# Altium project ConvertionBoard.PrjPcb
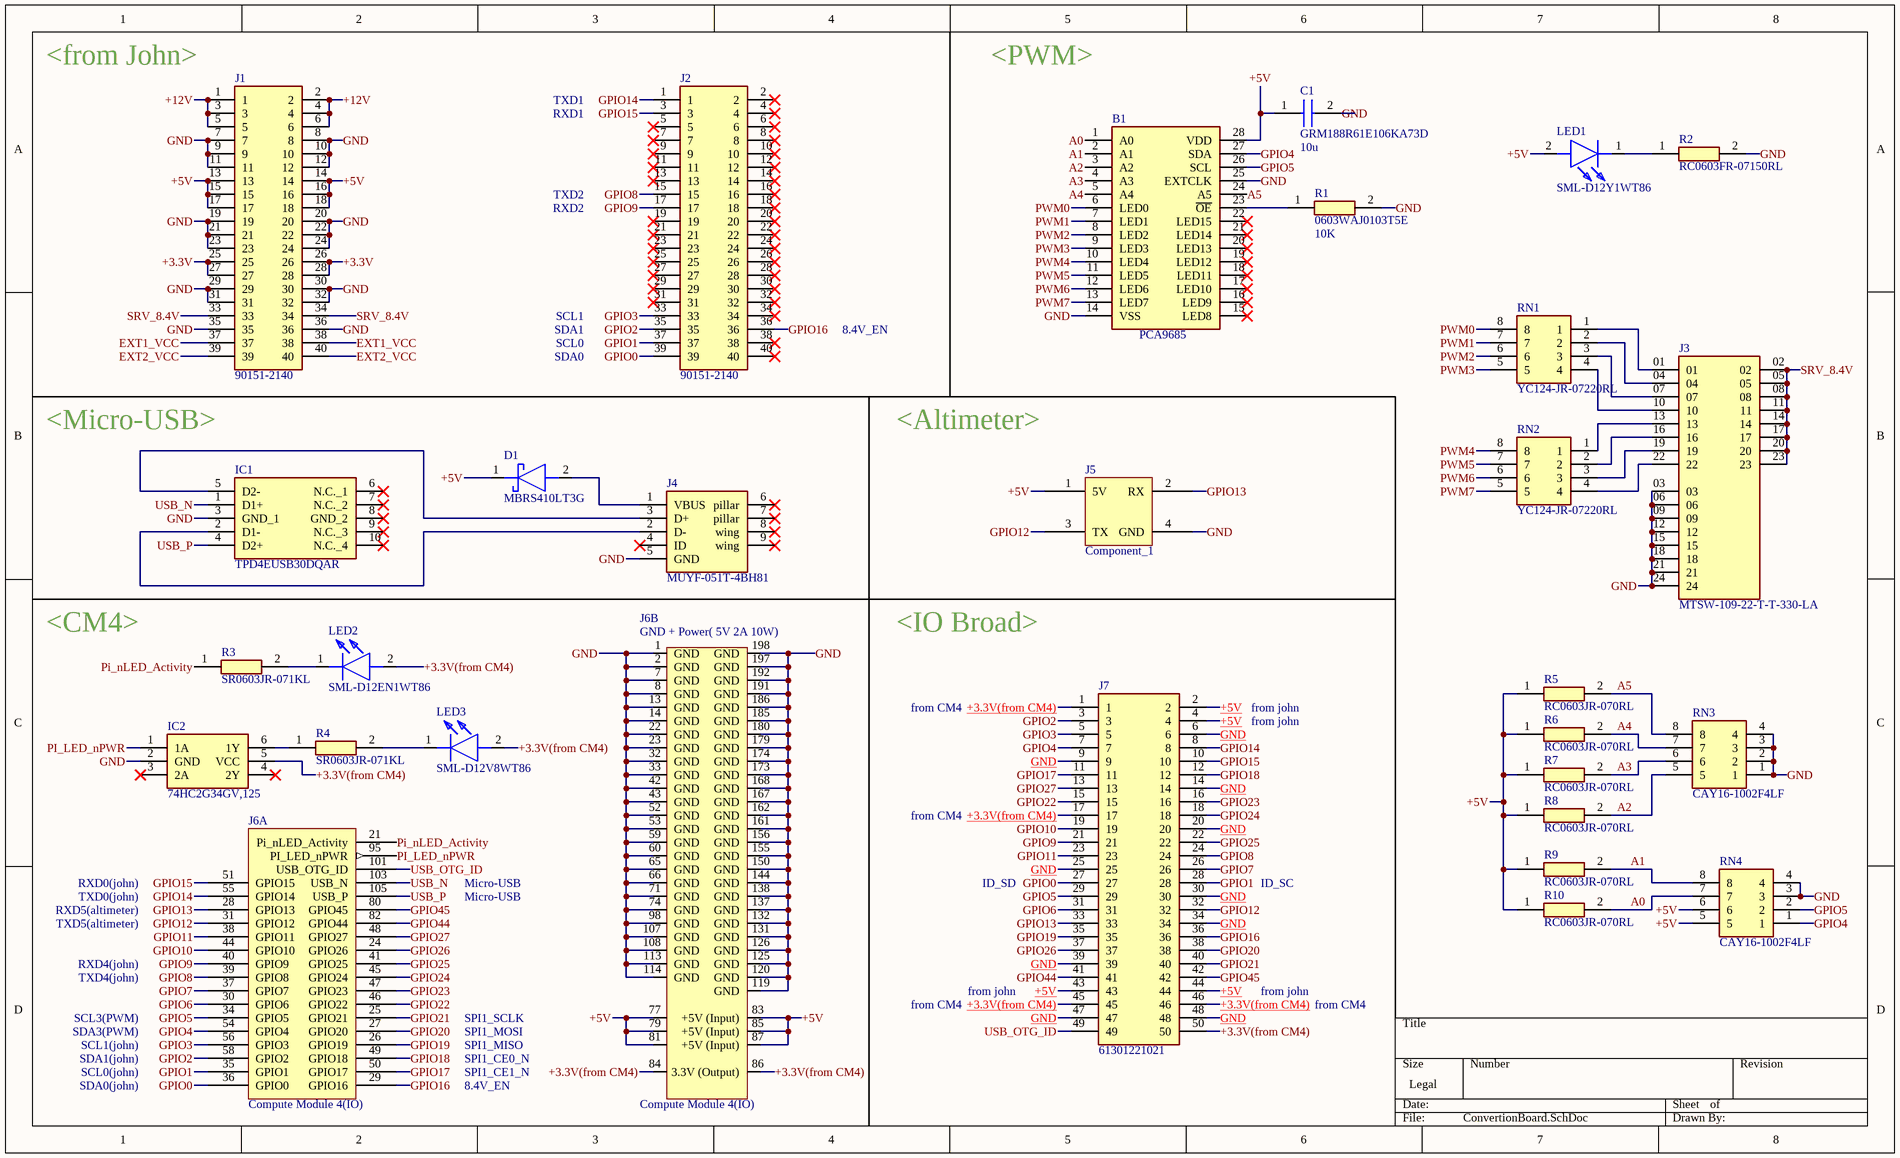
[diagram p0: ConvertionBoard.SchDoc]
1 sheet, 29 parts. Net scope: global (net labels, ports and power ports of the same name join across sheets).
Board file: ConvertionBoard.PcbDoc

## Sheet ConvertionBoard.SchDoc
size Legal

### Parts
B1  PCA9685  [PCA9685]
C1  GRM188R61E106KA73D  value 10u  [GRM18x]
D1  MBRS410LT3G  [DIOM8059X261N]
IC1  TPD4EUSB30DQAR  [DQA(R-PUSON-N10)]
IC2  74HC2G34GV,125  [SOT95P275X110-6N]
J1  90151-2140  [RHDR40W70P254_2X20_5065X498X870P]
J2  90151-2140  [RHDR40W70P254_2X20_5065X498X870P]
J3  MTSW-109-22-T-T-330-LA  [SAMTEC_MTSW-109-22-T-T-330-LA]
J4  MUYF-051T-4BH81  [473460001]
J5  Component_1  [Component_1]
J6  Compute Module 4(IO)  [CM4-F40C-100DS-0.4v_1.5mm_0mm]  (parts A,B of 2)
J7  61301221021  [61301221021 - output]
LED1  SML-D12Y1WT86  [LEDC1608X55N]
LED2  SML-D12EN1WT86  [LEDC1608X55N]
LED3  SML-D12V8WT86  [LEDC1608X55N]
R1  0603WAJ0103T5E  value 10K  [RESC1608X55N_10K]
R2  RC0603FR-07150RL  [RESC1608X55N_150]
R3  SR0603JR-071KL  [RESC1608X55N_0]
R4  SR0603JR-071KL  [RESC1608X55N_0]
R5  RC0603JR-070RL  [RESC1608X55N_0]
R6  RC0603JR-070RL  [RESC1608X55N_0]
R7  RC0603JR-070RL  [RESC1608X55N_0]
R8  RC0603JR-070RL  [RESC1608X55N_0]
R9  RC0603JR-070RL  [RESC1608X55N_0]
R10  RC0603JR-070RL  [RESC1608X55N_0]
RN1  YC124-JR-07220RL  [YC124JR07220RL]
RN2  YC124-JR-07220RL  [YC124JR07220RL]
RN3  CAY16-1002F4LF  [CAY-16-F4]
RN4  CAY16-1002F4LF  [CAY-16-F4]

### Nets
+3.3V: J1.25 J1.26 J1.27 J1.28
+3.3V(from CM4): IC2.5(VCC) J6.84(3.3V_(Output)) J6.86(3.3V_(Output)) J7.1 J7.17 J7.45 J7.46 J7.50 LED2.2(A) LED3.2(A)
+5V: B1.28(VDD) C1.1 D1.1(K) J1.13 J1.14 J1.15 J1.16 J1.17 J1.18 J5.1(5V) J6.77(+5V_(Input)) J6.79(+5V_(Input)) J6.81(+5V_(Input)) J6.83(+5V_(Input)) J6.85(+5V_(Input)) J6.87(+5V_(Input)) J7.2 J7.4 J7.43 J7.44 LED1.2(A) R5.1 R6.1 R7.1 R8.1 R9.1 R10.1 RN4.5 RN4.6
+12V: J1.1 J1.2 J1.3 J1.4 J1.5 J1.6
A0: B1.1(A0) R10.2 RN4.7
A1: B1.2(A1) R9.2 RN4.8
A2: B1.3(A2) R8.2 RN3.5
A3: B1.4(A3) R7.2 RN3.6
A4: B1.5(A4) R6.2 RN3.7
A5: B1.24(A5) R5.2 RN3.8
EXT1_VCC: J1.37 J1.38
EXT2_VCC: J1.39 J1.40
GND: B1.14(VSS) B1.25(EXTCLK) C1.2 IC1.3(GND_1) IC2.2(GND) J1.7 J1.8 J1.9 J1.10 J1.11 J1.12 J1.19 J1.20 J1.21 J1.22 J1.23 J1.24 J1.29 J1.30 J1.31 J1.32 J1.35 J1.36 J3.03 J3.06 J3.09 J3.12 J3.15 J3.18 J3.21 J3.24 J4.5(GND) J5.4(GND) J6.1(GND) J6.2(GND) J6.7(GND) J6.8(GND) J6.13(GND) J6.14(GND) J6.22(GND) J6.23(GND) J6.32(GND) J6.33(GND) J6.42(GND) J6.43(GND) J6.52(GND) J6.53(GND) J6.59(GND) J6.60(GND) J6.65(GND) J6.66(GND) J6.71(GND) J6.74(GND) J6.98(GND) J6.107(GND) J6.108(GND) J6.113(GND) J6.114(GND) J6.119(GND) J6.120(GND) J6.125(GND) J6.126(GND) J6.131(GND) J6.132(GND) J6.137(GND) J6.138(GND) J6.144(GND) J6.150(GND) J6.155(GND) J6.156(GND) J6.161(GND) J6.162(GND) J6.167(GND) J6.168(GND) J6.173(GND) J6.174(GND) J6.179(GND) J6.180(GND) J6.185(GND) J6.186(GND) J6.191(GND) J6.192(GND) J6.197(GND) J6.198(GND) J7.6 J7.9 J7.14 J7.20 J7.25 J7.30 J7.34 J7.39 J7.47 J7.48 R1.2 R2.2 RN3.1 RN3.2 RN3.3 RN3.4 RN4.3 RN4.4
GPIO0: J2.39 J6.36(GPIO0) J7.27
GPIO1: J2.37 J6.35(GPIO1) J7.28
GPIO2: J2.35 J6.58(GPIO2) J7.3
GPIO3: J2.33 J6.56(GPIO3) J7.5
GPIO4: B1.27(SDA) J6.54(GPIO4) J7.7 RN4.1
GPIO5: B1.26(SCL) J6.34(GPIO5) J7.29 RN4.2
GPIO6: J6.30(GPIO6) J7.31
GPIO7: J6.37(GPIO7) J7.26
GPIO8: J2.15 J6.39(GPIO8) J7.24
GPIO9: J2.17 J6.40(GPIO9) J7.21
GPIO10: J6.44(GPIO10) J7.19
GPIO11: J6.38(GPIO11) J7.23
GPIO12: J5.3(TX) J6.31(GPIO12) J7.32
GPIO13: J5.2(RX) J6.28(GPIO13) J7.33
GPIO14: J2.1 J6.55(GPIO14) J7.8
GPIO15: J2.3 J6.51(GPIO15) J7.10
GPIO16: J2.36 J6.29(GPIO16) J7.36
GPIO17: J6.50(GPIO17) J7.11
GPIO18: J6.49(GPIO18) J7.12
GPIO19: J6.26(GPIO19) J7.35
GPIO20: J6.27(GPIO20) J7.38
GPIO21: J6.25(GPIO21) J7.40
GPIO22: J6.46(GPIO22) J7.15
GPIO23: J6.47(GPIO23) J7.16
GPIO24: J6.45(GPIO24) J7.18
GPIO25: J6.41(GPIO25) J7.22
GPIO26: J6.24(GPIO26) J7.37
GPIO27: J6.48(GPIO27) J7.13
GPIO44: J6.82(GPIO44) J7.41
GPIO45: J6.80(GPIO45) J7.42
PI_LED_nPWR: IC2.1(1A) J6.95(PI_LED_nPWR)
Pi_nLED_Activity: J6.21(Pi_nLED_Activity) R3.1
PWM0: B1.6(LED0) RN1.8
PWM1: B1.7(LED1) RN1.7
PWM2: B1.8(LED2) RN1.6
PWM3: B1.9(LED3) RN1.5
PWM4: B1.10(LED4) RN2.8
PWM5: B1.11(LED5) RN2.7
PWM6: B1.12(LED6) RN2.6
PWM7: B1.13(LED7) RN2.5
SRV_8.4V: J1.33 J1.34 J3.02 J3.05 J3.08 J3.11 J3.14 J3.17 J3.20 J3.23
USB_N: IC1.1(D1+) J6.103(USB_N)
USB_OTG_ID: J6.101(USB_OTG_ID) J7.49
USB_P: IC1.4(D2+) J6.105(USB_P)
NetB1_23: B1.23(~{OE}) R1.1
NetD1_2: D1.2(A) J4.1(VBUS)
NetIC1_2: IC1.2(D1-) J4.2(D-)
NetIC1_5: IC1.5(D2-) J4.3(D+)
NetIC2_6: IC2.6(1Y) R4.1
NetJ3_01: J3.01 RN1.1
NetJ3_04: J3.04 RN1.2
NetJ3_07: J3.07 RN1.3
NetJ3_10: J3.10 RN1.4
NetJ3_13: J3.13 RN2.1
NetJ3_16: J3.16 RN2.2
NetJ3_19: J3.19 RN2.3
NetJ3_22: J3.22 RN2.4
NetLED1_1: LED1.1(K) R2.1
NetLED2_1: LED2.1(K) R3.2
NetLED3_1: LED3.1(K) R4.2

Not connected (* = marked no-connect by the designer): B1 15(LED8)* 16(LED9)* 17(LED10)* 18(LED11)* 19(LED12)* 20(LED13)* 21(LED14)* 22(LED15)*; IC1 6(N.C._1)* 7(N.C._2)* 8(GND_2)* 9(N.C._3)* 10(N.C._4)*; IC2 3(2A)* 4(2Y)*; J2 2* 4* 5* 6* 7* 8* 9* 10* 11* 12* 13* 14* 16* 18* 19* 20* 21* 22* 23* 24* 25* 26* 27* 28* 29* 30* 31* 32* 34* 38* 40*; J4 4(ID)* 6(pillar)* 7(pillar)* 8(wing)* 9(wing)*

### Notes on the sheet
- (near J1) <from John>
- TXD1
- <PWM>
- RXD1
- TXD2
- RXD2
- SDA0
- SCL0
- SCL1
- SDA1
- 8.4V_EN
- <Micro-USB>
- <Altimeter>
- <CM4>
- <IO Broad>
- from CM4
- from john
- TXD0(john)
- RXD5(altimeter)
- RXD0(john)
- Micro-USB
- ID_SD
- ID_SC
- TXD5(altimeter)
- TXD4(john)
- RXD4(john)
- SCL1(john)
- SDA3(PWM)
- SCL3(PWM)
- SPI1_MISO
- SPI1_MOSI
- SPI1_SCLK
- SDA0(john)
- SCL0(john)
- SDA1(john)
- SPI1_CE1_N
- SPI1_CE0_N
- (in symbol CM4_ALL, part B) GND + Power( 5V 2A 10W)

### Library data of the parts
B1 = PCA9685: PCA9685PW/Q900,118; Manufacturer_Name: NXP; Geometry.Height: 1.1mm; Mouser Part Number: 771-PCA9685PWQ900118; Mouser Price/Stock: https://www.mouser.co.uk/ProductDetail/NXP-Semiconductors/PCA9685PW-Q900118?qs=MWRe%252BjyhxRtZfKNN86P1Tg%3D%3D; Manufacturer_Part_Number: PCA9685PW/Q900,118; Datasheet Link: http://www.nxp.com/docs/en/data-sheet/PCA9685.pdf
C1 = GRM188R61E106KA73D: 10% 10uF Capacitor; Manufacturer_Name: Murata Electronics; Datasheet Link: https://search.murata.co.jp/Ceramy/image/img/A01X/G101/ENG/GRM188R61E106KA73-01A.pdf; Height: 0.8mm; Manufacturer_Part_Number: GRM188R61E106KA73D; Mouser Part Number: 81-GRM188R61E106KA3D; Mouser Price/Stock: https://www.mouser.co.uk/ProductDetail/Murata-Electronics/GRM188R61E106KA73D?qs=5aG0NVq1C4z8ebxPkQZf9A%3D%3D; Arrow Part Number: GRM188R61E106KA73D; Arrow Price/Stock: https://www.arrow.com/en/products/grm188r61e106ka73d/murata-manufacturing?region=nac
D1 = MBRS410LT3G: Schottky Diode; Manufacturer_Name: onsemi; Datasheet Link: https://www.onsemi.com/download/data-sheet/pdf/mbrs410lt3-d.pdf; Height: 2.61mm; Manufacturer_Part_Number: MBRS410LT3G; Mouser Part Number: 863-MBRS410LT3G; Mouser Price/Stock: https://www.mouser.co.uk/ProductDetail/onsemi/MBRS410LT3G?qs=3JMERSakebpTz7AxvU6YQw%3D%3D; Arrow Part Number: MBRS410LT3G; Arrow Price/Stock: https://www.arrow.com/en/products/mbrs410lt3g/on-semiconductor?region=nac
IC1 = TPD4EUSB30DQAR: Integrated Circuit; Manufacturer_Name: Texas Instruments; Datasheet Link: http://www.ti.com/lit/gpn/tpd4eusb30; Manufacturer_Part_Number: TPD4EUSB30DQAR; Mouser Part Number: 595-TPD4EUSB30DQAR; Mouser Price/Stock: https://www.mouser.co.uk/ProductDetail/Texas-Instruments/TPD4EUSB30DQAR?qs=Ze4%2FuFuz19JpY4uqYOLMbQ%3D%3D; Arrow Part Number: TPD4EUSB30DQAR; Arrow Price/Stock: https://www.arrow.com/en/products/tpd4eusb30dqar/texas-instruments?region=nac
IC2 = 74HC2G34GV,125: Integrated Circuit; Manufacturer_Name: Nexperia; Datasheet Link: https://assets.nexperia.com/documents/data-sheet/74HC_HCT2G34.pdf; Height: 1.1mm; Manufacturer_Part_Number: 74HC2G34GV,125; Mouser Part Number: 771-HC2G34GV125; Mouser Price/Stock: https://www.mouser.co.uk/ProductDetail/Nexperia/74HC2G34GV125?qs=P62ublwmbi9zqrfuyyEMgg%3D%3D; Arrow Part Number: 74HC2G34GV,125; Arrow Price/Stock: https://www.arrow.com/en/products/74hc2g34gv125/nexperia?region=nac
J1 J2 = 90151-2140: Headers; Manufacturer_Name: Molex; Geometry.Height: 8.7mm; Mouser Part Number: 538-90151-2140; Mouser Price/Stock: https://www.mouser.co.uk/ProductDetail/Molex/90151-2140?qs=WjPO6T6WDwtb8fg%2FDgSCUQ%3D%3D; Manufacturer_Part_Number: 90151-2140; Datasheet Link: https://componentsearchengine.com/Datasheets/1/90151-2140.pdf
J3 = MTSW-109-22-T-T-330-LA: PWM model pin; MF: Samtec; Package: None; Price: None; Value: *; MP: MTSW-109-22-T-T-330-LA; Availability: Unavailable
J4 = MUYF-051T-4BH81: Micro USB; Manufacturer_Name: Molex; Manufacturer_Part_Number: 47346-0001; Datasheet Link: http://www.molex.com/pdm_docs/sd/473460001_sd.pdf; Height: 2.68mm; Mouser Part Number: 538-47346-0001; Mouser Price/Stock: https://www.mouser.co.uk/ProductDetail/Molex/47346-0001?qs=c2CV6XM0DweJBWaSeyWeCw%3D%3D
J5 = Component_1: Altimeter pin
J6 = CM4_ALL
J7 = 61301221021: IO broad pin; Manufacturer_Name: Wurth Elektronik; Datasheet Link: https://katalog.we-online.de/em/datasheet/6130xx21021.pdf; Height: 5.23mm; Manufacturer_Part_Number: 61301221021; Mouser Part Number: 710-61301221021; Mouser Price/Stock: https://www.mouser.co.uk/ProductDetail/Wurth-Elektronik/61301221021?qs=PhR8RmCirEb%252B3uaPvVz5Gg%3D%3D
LED1 = SML-D12Y1WT86: Yellow LED (connect with 150ohm); Manufacturer_Name: ROHM Semiconductor; Datasheet Link: https://componentsearchengine.com/Datasheets/1/SML-D12Y1WT86.pdf; Height: 0.55mm; Manufacturer_Part_Number: SML-D12Y1WT86; Mouser Part Number: 755-SML-D12Y1WT86; Mouser Price/Stock: https://www.mouser.co.uk/ProductDetail/ROHM-Semiconductor/SML-D12Y1WT86?qs=M3jcYzEJUdG%2FAKvzZK%252Bz7w%3D%3D
LED2 = SML-D12EN1WT86: Green LED (connect with 1Kohm); Manufacturer_Name: ROHM Semiconductor; Manufacturer_Part_Number: SMLD12EN1WT86; Datasheet Link: https://datasheet.datasheetarchive.com/originals/distributors/Datasheets_SAMA/8f824a900f8c9a143b1c3640e6aee7b7.pdf; Height: 0.65mm; Mouser Part Number: 755-SMLD12EN1WT86; Mouser Price/Stock: https://www.mouser.co.uk/ProductDetail/ROHM-Semiconductor/SMLD12EN1WT86?qs=qSfuJ%252Bfl%2Fd4fR%252B9yZydIwg%3D%3D
LED3 = SML-D12V8WT86: Red LED (connect with 1Kohm); Manufacturer_Name: ROHM Semiconductor; Datasheet Link: https://www.rohm.com/datasheet?p=SML-D12V8W&dist=Digi-key&media=referral&source=digi-key.com&campaign=Digi-key; Height: 0.65mm; Manufacturer_Part_Number: SML-D12V8WT86; Mouser Part Number: 755-SML-D12V8WT86; Mouser Price/Stock: https://www.mouser.co.uk/ProductDetail/ROHM-Semiconductor/SML-D12V8WT86?qs=4kLU8WoGk0uh2PhEoCCv1w%3D%3D; Arrow Part Number: SML-D12V8WT86; Arrow Price/Stock: https://www.arrow.com/en/products/sml-d12v8wt86/rohm-semiconductor
R1 = 0603WAJ0103T5E: 5% 10K Resistor; Manufacturer_Name: ROYALOHM; Datasheet Link: https://eu.mouser.com/datasheet/2/1365/1-3044649.pdf; Height: 0.55mm; Manufacturer_Part_Number: 0603WAJ0103T5E; Mouser Part Number: 303-0603WAJ0103T5E; Mouser Price/Stock: https://www.mouser.co.uk/ProductDetail/Royalohm/0603WAJ0103T5E?qs=e8oIoAS2J1RbD%2Fl9RKhEzg%3D%3D
R2 = RC0603FR-07150RL: 1% 150 Resistor; Manufacturer_Name: KEMET; Datasheet Link: http://www.yageo.com/documents/recent/PYu-RC0603_51_RoHS_L_v5.pdf; Height: 0.55mm; Manufacturer_Part_Number: RC0603FR-07150RL; Mouser Part Number: 603-RC0603FR-07150RL; Mouser Price/Stock: https://www.mouser.co.uk/ProductDetail/YAGEO/RC0603FR-07150RL?qs=NiiRlmYYPUWAQinXJi92kg%3D%3D; Arrow Part Number: RC0603FR-07150RL; Arrow Price/Stock: https://www.arrow.com/en/products/rc0603fr-07150rl/yageo?region=europe
R3 R4 = SR0603JR-071KL: 5% 1K Resistor; Manufacturer_Name: YAGEO; Manufacturer_Part_Number: RC0603JR-070RL; Datasheet Link: https://componentsearchengine.com/Datasheets/2/RC0603JR-070RL.pdf; Height: 0.55mm; Mouser Part Number: 603-RC0603JR-070RL; Mouser Price/Stock: https://www.mouser.co.uk/ProductDetail/YAGEO/RC0603JR-070RL?qs=2cAdsCoAWRGWyPcuXgGiXQ%3D%3D; Arrow Part Number: RC0603JR-070RL; Arrow Price/Stock: https://www.arrow.com/en/products/rc0603jr-070rl/yageo?utm_currency=USD&region=nac
R5-R10 = RC0603JR-070RL: 5% 0 Resistor; Manufacturer_Name: YAGEO; Datasheet Link: https://componentsearchengine.com/Datasheets/2/RC0603JR-070RL.pdf; Height: 0.55mm; Manufacturer_Part_Number: RC0603JR-070RL; Mouser Part Number: 603-RC0603JR-070RL; Mouser Price/Stock: https://www.mouser.co.uk/ProductDetail/YAGEO/RC0603JR-070RL?qs=2cAdsCoAWRGWyPcuXgGiXQ%3D%3D; Arrow Part Number: RC0603JR-070RL; Arrow Price/Stock: https://www.arrow.com/en/products/rc0603jr-070rl/yageo?utm_currency=USD&region=nac
RN1 RN2 = YC124-JR-07220RL: 5％ 220 Resistor Network; Manufacturer_Name: YAGEO; Datasheet Link: https://www.yageo.com/upload/media/product/productsearch/datasheet/rchip/PYu-YC_TC_group_51_RoHS_L_9.pdf; Height: 0.55mm; Manufacturer_Part_Number: YC124-JR-07220RL
RN3 RN4 = CAY16-1002F4LF: 1% 10K Resistor Network(lab have); Manufacturer_Name: Bourns; Datasheet Link: http://uk.rs-online.com/web/p/products/7408767; Manufacturer_Part_Number: CAY16-1002F4LF; Mouser Part Number: 652-CAY16-1002F4LF; Mouser Price/Stock: https://www.mouser.co.uk/ProductDetail/Bourns/CAY16-1002F4LF?qs=wmwo6QmEuAgjwXvnc%2FYHSA%3D%3D; Arrow Part Number: CAY16-1002F4LF; Arrow Price/Stock: https://www.arrow.com/en/products/cay16-1002f4lf/bourns?region=nac